# Altium project PCB_CNC.PrjPcb
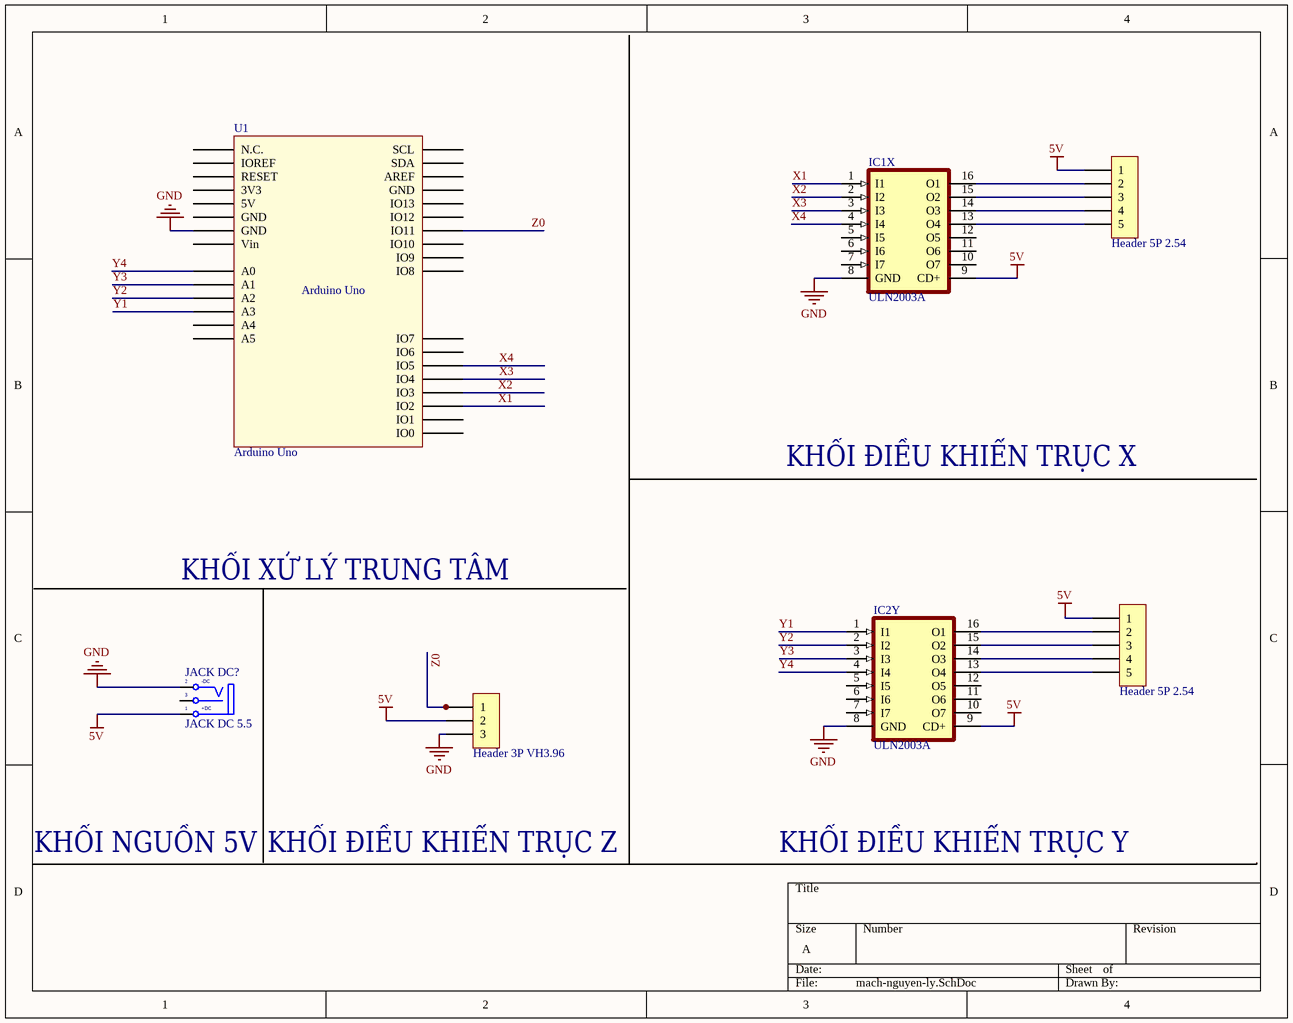
[diagram p0: mach-nguyen-ly.SchDoc]
1 sheet, 7 parts. Net scope: global (net labels, ports and power ports of the same name join across sheets).
Board file: mach-in.PcbDoc

## Sheet mach-nguyen-ly.SchDoc
size A

### Parts
HX  Header 5P 2.54  [XH2.54M-5]
HY  Header 5P 2.54  [XH2.54M-5]
HZ  Header 3P VH3.96  [XH2.54M-3]
IC1X  ULN2003A  [DIL16]
IC2Y  ULN2003A  [DIL16]
JACK_DC?  JACK DC 5.5  [JACK DC 5.5]
U1  Arduino Uno  [Arduino Uno]

### Nets
5V: HX.1 HY.1 HZ.2 IC1X.9(CD+) IC2Y.9(CD+) JACK_DC?.1(T)
GND: HZ.3 IC1X.8(GND) IC2Y.8(GND) JACK_DC?.2(TN) U1.GND2(GND)
X1: IC1X.1(I1) U1.2(IO2)
X2: IC1X.2(I2) U1.3(IO3)
X3: IC1X.3(I3) U1.4(IO4)
X4: IC1X.4(I4) U1.5(IO5)
Y1: IC2Y.1(I1) U1.A3
Y2: IC2Y.2(I2) U1.A2
Y3: IC2Y.3(I3) U1.A1
Y4: IC2Y.4(I4) U1.A0
Z0: HZ.1 U1.11(IO11)
NetHX_2: HX.2 IC1X.16(O1)
NetHX_3: HX.3 IC1X.15(O2)
NetHX_4: HX.4 IC1X.14(O3)
NetHX_5: HX.5 IC1X.13(O4)
NetHY_2: HY.2 IC2Y.16(O1)
NetHY_3: HY.3 IC2Y.15(O2)
NetHY_4: HY.4 IC2Y.14(O3)
NetHY_5: HY.5 IC2Y.13(O4)

Not connected (* = marked no-connect by the designer): IC1X 5(I5) 6(I6) 7(I7) 10(O7) 11(O6) 12(O5); IC2Y 5(I5) 6(I6) 7(I7) 10(O7) 11(O6) 12(O5); JACK_DC? 3(S); U1 0(IO0) 1(IO1) 3V3 5V 6(IO6) 7(IO7) 8(IO8) 9(IO9) 10(IO10) 12(IO12) 13(IO13) A4 A5 AREF GND1(GND) GND3(GND) IOREF NC(N.C.) RESET SCL SDA Vin

### Notes on the sheet
- KHỐI ĐIỀU KHIỂN TRỤC X
- KHỐI XỬ LÝ TRUNG TÂM
- KHỐI NGUỒN 5V
- KHỐI ĐIỀU KHIỂN TRỤC Z
- KHỐI ĐIỀU KHIỂN TRỤC Y
- (in symbol JACK DC 5.5) -DC; +DC

### Library data of the parts
HX HY = Header 5P 2.54 Duc Thang: Cắm; Ten_Linh_Kien: Header 5P XH2.54-5P Đực Thẳng; Don_Vi: Con; Ma_Hang: MH001298; Chung_Loai: Cắm
HZ = Header 3P 2.54 Duc Thang: Cắm; Ten_Linh_Kien: Header 3P XH2.54-3P Đực Thẳng; Don_Vi: Con; Ma_Hang: MH001292; Chung_Loai: Cắm
IC1X IC2Y = ULN2003A: Bipolar _BJT_ Transistor Array 7 NPN Darlington 50V 500mA Through Hole 16-DIP; MF: STMicroelectronics; Price: None; Package: DIP-16 STMicroelectronics; Value: *; MP: ULN2003A; Availability: Unavailable; SnapEDA_Link: https://www.snapeda.com/parts/ULN2003A/STMicroelectronics/view-part/4503171/?ref=snap
JACK_DC? = JACK DC 5.5: Value: Jac DC